# EAGLE design LiPo Charger Plus (EAGLE 9.1.1)
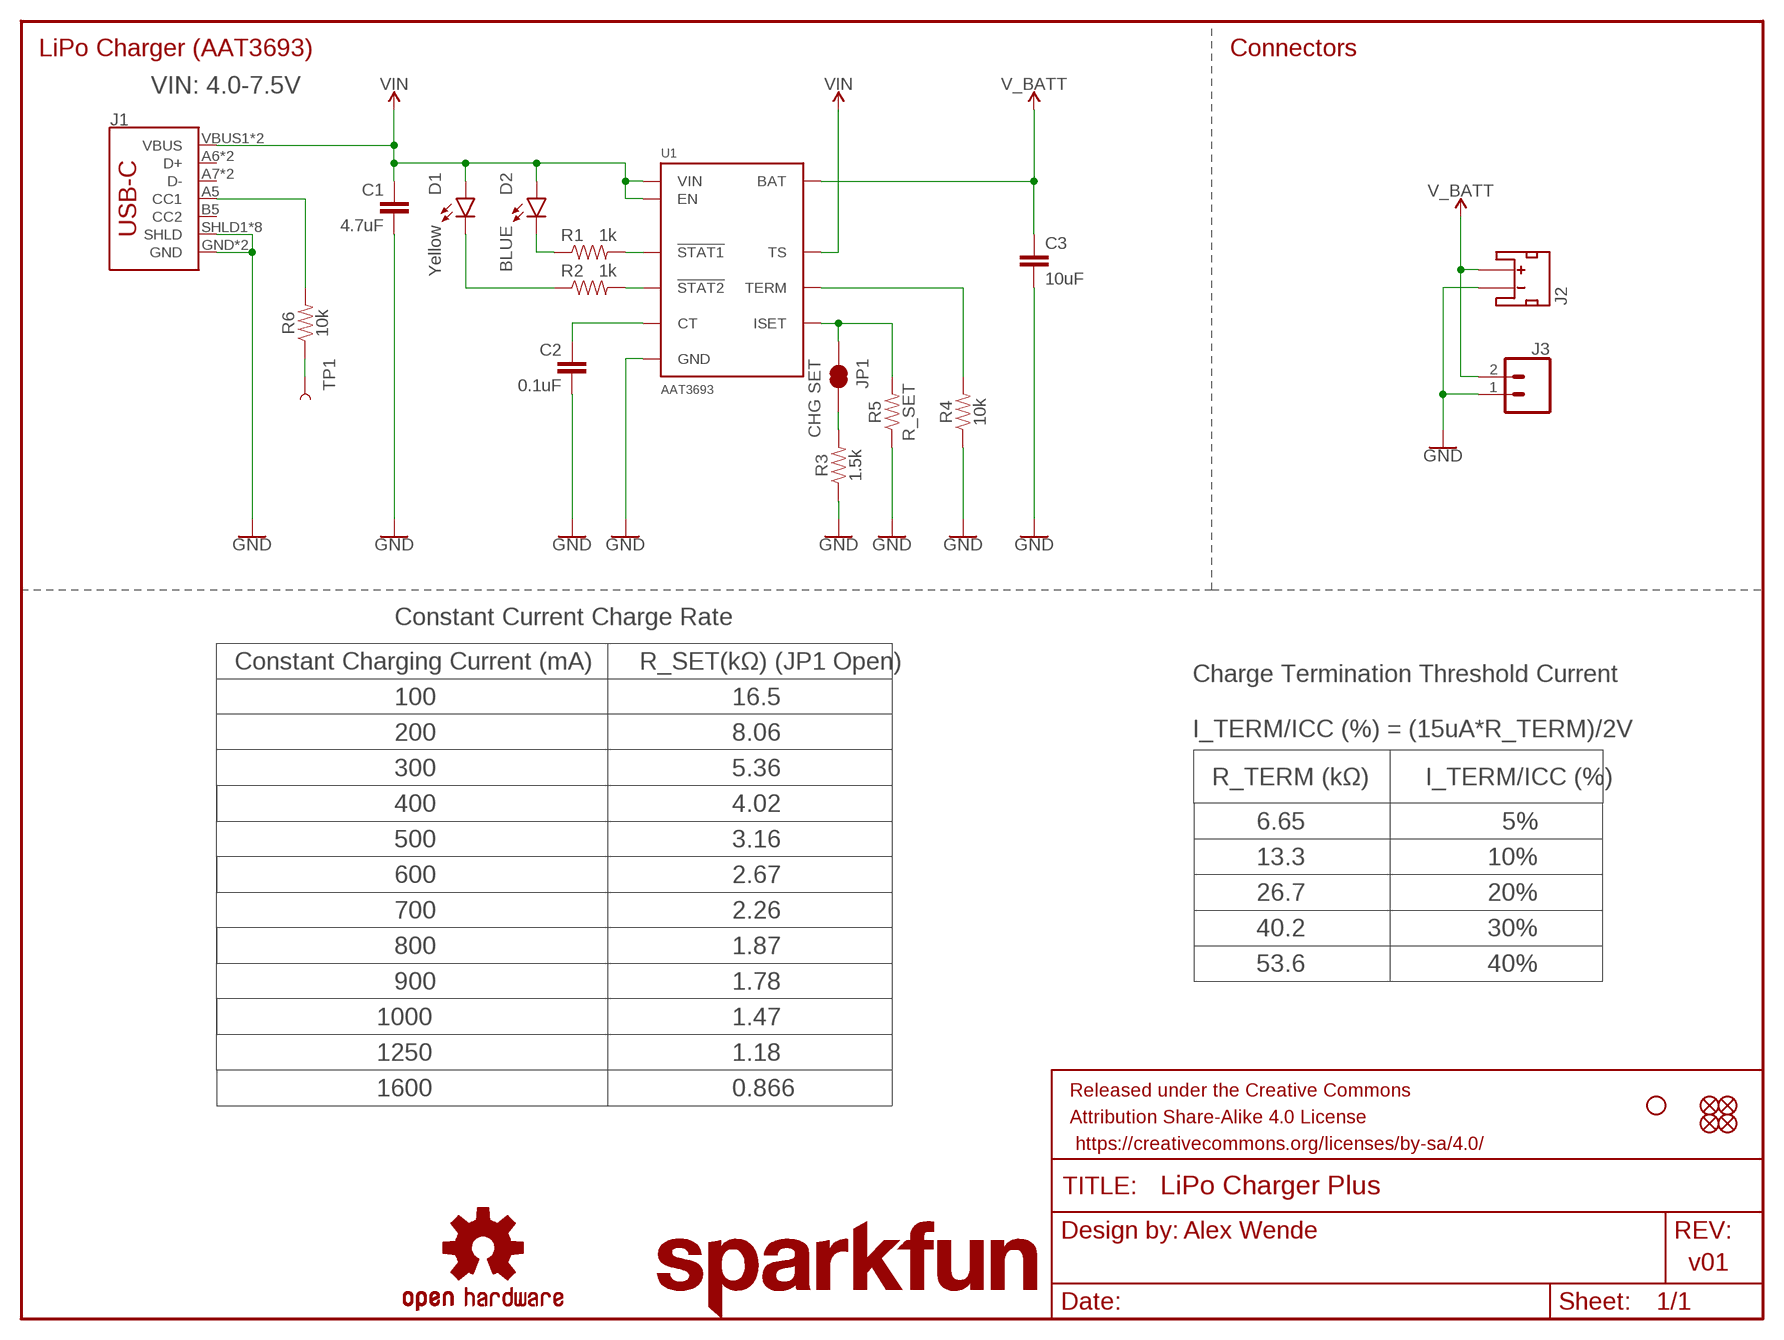
[diagram p0: schematic, sheet 1]

## Parts
C1  4.7uF  4.7UF-0603-35V-(20%)  [0603]
C2  0.1uF  0.1UF-0603-25V-(+80/-20%)  [0603]
C3  10uF  10UF-0603-6.3V-20%  [0603]
D1  Yellow  LED-YELLOW0603  [LED-0603]
D2  BLUE  LED-BLUE0603  [LED-0603]
FD1  FIDUCIALUFIDUCIAL  [FIDUCIAL-MICRO]
FD2  FIDUCIALUFIDUCIAL  [FIDUCIAL-MICRO]
FD3  FIDUCIALUFIDUCIAL  [FIDUCIAL-MICRO]
FD4  FIDUCIALUFIDUCIAL  [FIDUCIAL-MICRO]
FRAME1  FRAME-LETTER  [CREATIVE_COMMONS]
H1  STAND-OFF  [STAND-OFF]
J1  USB_C16PIN  [USB-C-16P]
J2  JST_2MM_MALE  [JST-2-SMD]
J3  CONN_021X02_NO_SILK  [1X02_NO_SILK]
JP1  CHG SET  JUMPER-SMT_2_NC_TRACE_NO-SILK  [SMT-JUMPER_2_NC_TRACE_NO-SILK]
LOGO2  SFE_LOGO_NAME.1_INCH  [SFE_LOGO_NAME_.1]
LOGO3  OSHW-LOGOS  [OSHW-LOGO-S]
R1  1k  1KOHM-0603-1/10W-1%  [0603]
R2  1k  1KOHM-0603-1/10W-1%  [0603]
R3  1.5k  1.5KOHM-0603-1/10W-1%  [0603]
R4  10k  10KOHM-0603-1/10W-1%  [0603]
R5  R_SET  RESISTORAXIAL-0.3  [AXIAL-0.3]
R6  10k  10KOHM-0603-1/10W-1%  [0603]
TP1  TEST-POINTTP_15TH_THRU  [TP_15TH]
U1  AAT3693  [WFDFN-10]

## Nets
GND: C1.2 C2.2 C3.2 J1.GND J1.GND2(GND) J1.SHLD1(SHLD) J1.SHLD2(SHLD) J1.SHLD3(SHLD) J1.SHLD4(SHLD) J1.SHLD5(SHLD) J1.SHLD6(SHLD) J1.SHLD7(SHLD) J1.SHLD8(SHLD) J2.1(-) J3.1 R3.1 R4.1 R5.P$1 U1.P$5(GND) U1.P$11(GND)
N$1: D2.C R1.1
N$2: JP1.2 R3.2
N$3: J1.A5(CC1) R6.2
N$4: D1.C R2.1
N$5: R1.2 U1.P$2(!STAT1)
N$6: R2.2 U1.P$3(!STAT2)
N$7: R6.1 TP1.P$1
N$11: C2.1 U1.P$6(CT)
N$15: JP1.1 R5.P$2 U1.P$7(ISET)
N$16: R4.2 U1.P$8(TERM)
V_BATT: C3.1 J2.2(+) J3.2 U1.P$10(BAT)
VIN: C1.1 D1.A D2.A J1.VBUS1(VBUS) J1.VBUS2(VBUS) U1.P$1(VIN) U1.P$4(EN) U1.P$9(TS)
Unconnected: J1.A6(D+) J1.A7(D-) J1.B5(CC2) J1.B6(D+) J1.B7(D-) J2.NC1(PAD1) J2.NC2(PAD2)

## Notes on the sheet
- LiPo Charger (AAT3693) | Connectors
- VIN: 4.0-7.5V
- Constant Current Charge Rate
- Constant Charging Current (mA) | R_SET(kΩ) (JP1 Open)
- Charge Termination Threshold Current
- 100 | 16.5
- 200 | 8.06 | I_TERM/ICC (%) = (15uA*R_TERM)/2V
- 300 | 5.36
- R_TERM (kΩ) | I_TERM/ICC (%)
- 400 | 4.02
- 6.65 | 5%
- 500 | 3.16
- 13.3 | 10%
- 600 | 2.67
- 26.7 | 20%
- 700 | 2.26
- 40.2 | 30%
- 800 | 1.87
- 53.6 | 40%
- 900 | 1.78
- 1000 | 1.47
- 1250 | 1.18
- 1600 | 0.866
- Alex Wende
- v01

## Library data of the parts
C1 = SparkFun-Capacitors:4.7UF: 4.7µF ceramic capacitors A capacitor is a passive two-terminal electrical component used to store electrical energy temporarily in an electric field.; PROD_ID: CAP-14106
C2 = SparkFun-Capacitors:0.1UF: 0.1µF ceramic capacitors A capacitor is a passive two-terminal electrical component used to store electrical energy temporarily in an electric field.; PROD_ID: CAP-00810
C3 = SparkFun-Capacitors:10UF: 10.0µF ceramic capacitors A capacitor is a passive two-terminal electrical component used to store electrical energy temporarily in an electric field.; PROD_ID: CAP-11015
D1 = SparkFun-LED:LED-YELLOW: Yellow SMD LED Used in manufacturing several products at SparkFun. Packages: 0603 - SMD 0603 package[Product Link] <http://www.kingbrightusa.com/product.asp?catalog_name=LED&product_id=APT1608SYCK> 0603 -SMART - SMART SMD 0603 package (more efficient/more expensive) [Product Link] <http://www.osram-os.com/osram_os/en/products/product-catalog/led-light-emitting-diodes/smartled-0603/ly-l29k/index.jsp> LilyPad - SMD1206 package[Product Datasheet] <https://www.sparkfun.com/datasheets/DevTools/LilyPad/Q150YUS4.pdf> SparkFun Products: Blynk Board <https://www.sparkfun.com/products/13794> IOIO-OTG <https://www.sparkfun.com/products/13613> XBee Explorer Serial <https://www.sparkfun.com/products/13225>; PROD_ID: DIO-09003
D2 = SparkFun-LED:LED-BLUE: Blue SMD LED Used in manufacturing of various products at SparkFun Packages: 0603 - SMD 0603 package [Product Link] <http://www.digikey.com/product-detail/en/SMLE12BC7TT86/511-1589-2-ND/1641808> 1206 - SMD1206 package [Product Link] <http://www.digikey.com/product-detail/en/lite-on-inc/LTST-C150TBKT/160-1643-1-ND/573584> SparkFun Products: ESP8266 Thing-Dev Board <https://www.sparkfun.com/products/13711> RedBoard <https://www.sparkfun.com/products/12757>; PROD_ID: DIO-08575
FD1-FD4 = SparkFun-Aesthetics:FIDUCIAL: Fiducial Alignment Points Point-of-reference for pick-and-place machines and other optical instruments.
FRAME1 = SparkFun-Aesthetics:FRAME-LETTER: Schematic Frame - Letter Standard 8.5x11 US Letter frame
H1 = SparkFun-Hardware:STAND-OFF: Stand Off Drill holes for mechanically mounting via screws, standoffs, etc. Note: Use the keepout ring to avoid running the screw head into surrounding components. Variant Overviews STAND-OFF - Mechanical footprint for a #4 phillips button head screw. STAND-OFF-TIGHT - Mechanical footprint for a #4 phillips button head screw, Example SparkFun Products Screw - Phillips Head (1/4", 4-40, 10 pack) <https://www.sparkfun.com/products/10453> (PRT-10453) Screw - Phillips Head (1/2", 4-40, 10 pack) <https://www.sparkfun.com/products/10452> (PRT-10452) Screw - Phillips Head (3/4", 4-40, 10 pack) <https://www.sparkfun.com/products/10451> (PRT-10451) Screw - Phillips Head (1", 4-40, 10 pack) <https://www.sparkfun.com/products/10450> (PRT-10450)
J1 = SparkFun-Connectors:USB_C: USB Type C 16Pin Connector Super Speed pins not available on the 16-pin purely SMD connector so this part is best for USB 2.0 implementations. D1 and D2 are tied together enabling D+/- no matter which way the cable is plugged into the connector. The two channel configuration pins (CC1/2) are exposed. These are normally connected to ground via 5.1k resistors but can be reconfigured for high current/high power applications.; PROD_ID: CONN-14122
J2 = SparkFun-Connectors:JST_2MM_MALE: JST 2MM MALE RA CONNECTOR Two pin, compact surface mount connector. Commonly used as a battery input connection point. We really like the solid locking feeling and high current rating on these small connectors. We use these all the time as battery connectors. Mates to single-cell LiPo batteries. Here is the connector we sell at SparkFun: JST Right Angle Connector - White <https://www.sparkfun.com/products/8612> (PRT-08612) Datasheet <http://www.sparkfun.com/datasheets/Prototyping/Connectors/JST-Horizontal.pdf> It was used on these SparkFun products: SparkFun MOSFET Power Controller <https://www.sparkfun.com/products/11214> (PRT-11214) SparkFun Battery Babysitter - LiPo Battery Manager <https://www.sparkfun.com/products/13777> (PRT-13777) And many, many others that required a lipo battery connection.; PROD_ID: CONN-11443; SF_ID: PRT-08612
J3 = SparkFun-Connectors:CONN_02: Multi connection point. Often used as Generic Header-pin footprint for 0.1 inch spaced/style header connections On any of the 0.1 inch spaced packages, you can populate with these: Break Away Headers - Straight <https://www.sparkfun.com/products/116> (PRT-00116) Break Away Male Headers - Right Angle <https://www.sparkfun.com/products/553> (PRT-00553) Female Headers <https://www.sparkfun.com/products/115> (PRT-00115) Break Away Headers - Machine Pin <https://www.sparkfun.com/products/117> (PRT-00117) Break Away Female Headers - Swiss Machine Pin <https://www.sparkfun.com/products/743> (PRT-00743) For SCREWTERMINALS and SPRING TERMINALS visit here: Screw Terimnals on SparkFun.com <https://www.sparkfun.com/search/results?term=Screw+Terminals> (5mm/3.5mm/2.54mm spacing) This device is also useful as a general connection point to wire up your design to another part of your project. Our various solder wires solder well into these plated through hole pads. Hook-Up Wire - Assortment (Stranded, 22 AWG) <https://www.sparkfun.com/products/11375> (PRT-11375) Hook-Up Wire - Assortment (Solid Core, 22 AWG) <https://www.sparkfun.com/products/11367> (PRT-11367) View the entire wire category on our website here <https://www.sparkfun.com/categories/141> Special notes: Molex polarized connector foot print use with: PRT-08233 with associated crimp pins and housings. 2.54_SCREWTERM for use with PRT-10571. 3.5mm Screw Terminal footprints for PRT-08084 5mm Screw Terminal footprints for use with PRT-08432
JP1 = SparkFun-Jumpers:JUMPER-SMT_2_NC_TRACE: Normally closed trace jumper This jumper has a trace between two pads so it's normally closed (NC). Use a razor knife to open the connection. For best results follow the IPC guidelines for cutting traces: Cutout at least 0.063 mm (0.005 in). Remove all loose material to clean up the cut area. Seal the cut with an approved epoxy. Reapply solder to reclose the connection.
LOGO2 = SparkFun-Aesthetics:SFE_LOGO_NAME: SparkFun Font Logo This is the SparkFun name logo. The logo on the schematic will always be the same size; the package variant is the height of the flame part of the logo (or the height the flame would be, if it were drawn). Default layer for the logo on the board is tSilk.
LOGO3 = SparkFun-Aesthetics:OSHW-LOGO: Open-Source Hardware (OSHW) Logo This logo indicates the piece of hardware it is found on incorporates a OSHW license and/or adheres to the definition of open source hardware found here: http://freedomdefined.org/OSHW
R1 R2 = SparkFun-Resistors:1KOHM: 1kΩ resistor A resistor is a passive two-terminal electrical component that implements electrical resistance as a circuit element. Resistors act to reduce current flow, and, at the same time, act to lower voltage levels within circuits. - Wikipedia; PROD_ID: RES-07856
R3 = SparkFun-Resistors:1.5KOHM: 1.5kΩ resistor A resistor is a passive two-terminal electrical component that implements electrical resistance as a circuit element. Resistors act to reduce current flow, and, at the same time, act to lower voltage levels within circuits. - Wikipedia; PROD_ID: RES-08306
R4 R6 = SparkFun-Resistors:10KOHM: 10kΩ resistor A resistor is a passive two-terminal electrical component that implements electrical resistance as a circuit element. Resistors act to reduce current flow, and, at the same time, act to lower voltage levels within circuits. - Wikipedia; PROD_ID: RES-00824
R5 = SparkFun-Resistors:RESISTOR: Generic Resistor Package
TP1 = SparkFun-Connectors:TEST-POINT: SparkFun Test Points Bare copper test points for troubleshooting or In-Circuit-Testing. These are used by our Production team for verifying production board runs using pogo-pins on test beds. SparkFun Products: SparkFun LSM9DS1 Breakout <https://www.sparkfun.com/products/13284> SparkFun PSOC <https://www.sparkfun.com/products/13714> SparkFun Load Cell Amplifier <https://www.sparkfun.com/products/13879>
U1 = SparkFun-IC-Power:AAT3693; PROD_ID: IC-14276

## Board
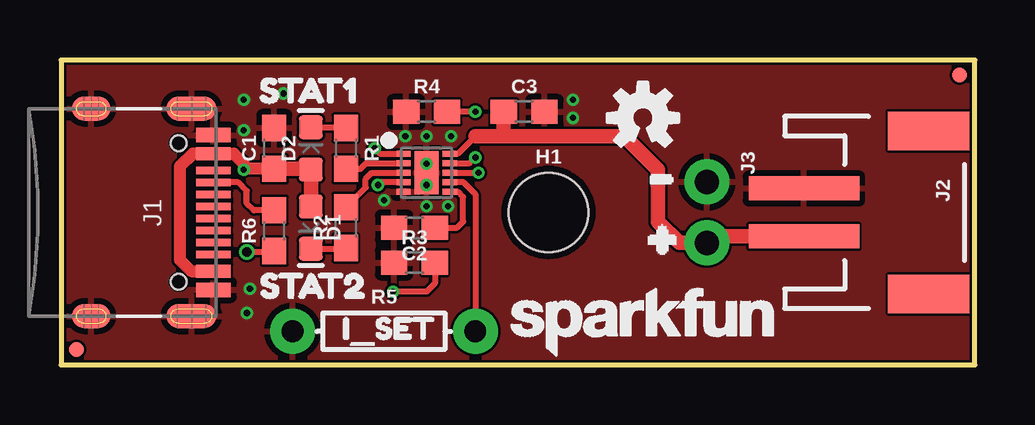
[diagram p1: board, top side]
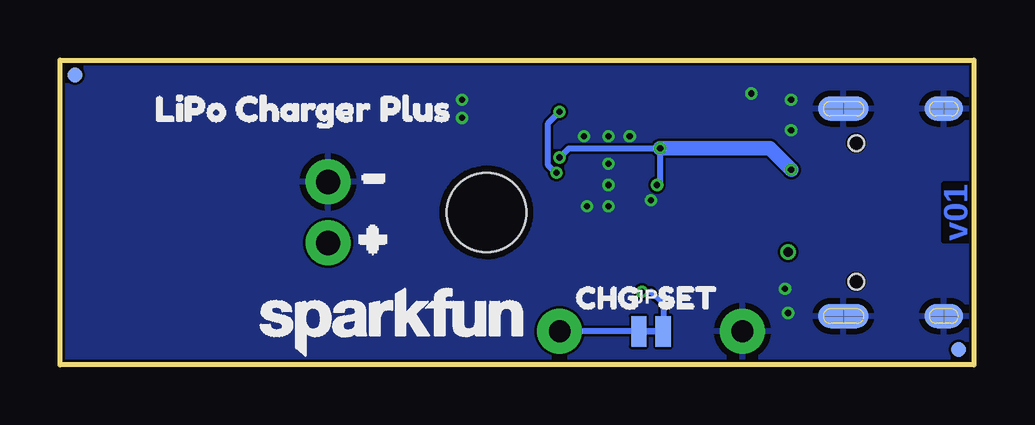
[diagram p2: board, bottom side, seen from below]

Size 38.1 x 12.7 mm. Coordinates in mm from the lower left corner, seen from the top.
Outline: 0,0 38.1,0 38.1,12.7 0,12.7 0,0
Copper layers (1*16): Top 0.035mm / dielectric 1.5mm / Bottom 0.035mm
Design rules "SparkFun-2-layer-FAB-LIMIT": minimum track width 4mil, minimum drill 6mil, track to track 4mil, track to pad 4mil, pad to pad 4mil, via to via 4mil, smd to smd 4mil, copper to edge 4mil, drill to drill 4mil, minimum pad ring 5mil, minimum via ring 5mil, stop-mask expansion 4mil, vias tented up to drill 25mil, thermal gap 10mil

### Footprints (pad centres in the part's own frame; a part is rotated, then mirrored left to right if it is on the bottom)
0603 = smd 1.1 x 1: 1 -0.85,0; 2 0.85,0
LED-0603 = smd 1 x 1: A -0.877,0; C 0.877,0
FIDUCIAL-MICRO = smd 0.635 x 0.635: 1 0,0
STAND-OFF = hole 3.302: 0,0
USB-C-16P = smd 0.3 x 1.45: A5 -1.25,0; A6 -0.25,0; A7 0.25,0; A8 1.25,0; B5 1.75,0; B6 0.75,0; B7 -0.75,0; B8 -1.75,0 | smd 0.6 x 1.45: GND -3.225,0; GND2 3.225,0 | smd 1 x 2.1: SHLD1 -4.32,-0.915; SHLD2 4.32,-0.915 | smd 1 x 2.1 bottom: SHLD3 -4.32,-0.915; SHLD4 4.32,-0.915 | smd 1 x 1.6: SHLD5 -4.32,-5.095; SHLD8 4.32,-5.095 | smd 1 x 1.6 bottom: SHLD6 -4.32,-5.095; SHLD7 4.32,-5.095 | smd 0.55 x 1.45: VBUS1 -2.45,0; VBUS2 2.45,0 | hole 0.65: -2.89,-1.445; 2.89,-1.445
JST-2-SMD = smd 1 x 4.6: 1 -1,-3.7; 2 1,-3.7 | smd 1.6 x 3.4: NC1 -3.4,1.5; NC2 3.4,1.5
1X02_NO_SILK = drill 1.016 pad 1.88: 1 0,0; 2 2.54,0
SMT-JUMPER_2_NC_TRACE_NO-SILK = smd 0.635 x 1.27: 1 -0.508,0; 2 0.508,0
AXIAL-0.3 = drill 0.9 pad 1.88: P$1 -3.81,0; P$2 3.81,0
TP_15TH = drill 0.381 pad 0.61: P$1 0,0
WFDFN-10 = smd 0.6 x 0.25: P$1 -0.96,0.8; P$2 -0.96,0.4; P$3 -0.96,0; P$4 -0.96,-0.4; P$5 -0.96,-0.8; P$6 0.96,-0.8; P$7 0.96,-0.4; P$8 0.96,0; P$9 0.96,0.4; P$10 0.96,0.8 | smd 1 x 1.8: P$11 0,0

### Placement (x,y rotation side)
C1  8.89,9.02 90 top
C2  14.73,5.71 180 top
C3  19.3,10.54 0 top
D1  10.41,5.71 270 top
D2  10.41,9.02 90 top
FD1  0.64,0.64 0 top
FD2  37.47,12.06 0 top
FD3  0.64,0.64 0 bottom
FD4  37.47,12.06 0 bottom
FRAME1  -7.62,-19.05 0 top  (outside the outline)
H1  20.32,6.35 0 top
J1  6.35,6.35 270 top
J2  34.67,6.35 270 top
J3  26.92,7.62 270 top
JP1  13.46,1.4 0 bottom
LOGO2  24.26,1.78 0 bottom
LOGO3  24.26,10.29 0 top
R1  11.87,9.02 270 top
R2  11.87,5.71 90 top
R3  14.73,4.25 0 top
R4  15.24,10.54 0 top
R5  13.46,1.4 0 top
R6  8.89,5.59 90 top
TP1  7.75,4.7 0 top
U1  15.24,8 0 top
U$1  [STAT12]  7.37,11.43 0 top
U$2  [STAT23]  7.37,3.3 0 top
U$3  [I_SET2]  10.92,1.52 0 top
U$4  [#1]  22.86,4.95 180 bottom
U$5  [#0]  22.86,7.37 180 bottom
U$6  [LIPO_CHARGER_PLUS5]  35.05,10.67 0 bottom
U$7  [CHG2]  17.4,2.79 0 bottom
U$8  [SET3]  13.97,2.79 0 bottom
U$10  [SFE_LOGO_NAME_.1]  24.26,1.78 0 top
U$11  [#1]  22.86,5.46 0 top
U$12  [#0]  22.86,8.13 0 top

### Tracks (layer width: path | path; a pad name or v marks a point on that pad's centre or on a via)
GND  (via drill 0.25)
  other vias: 13.46,6.86 16.13,6.6 15.24,6.6 16.26,9.53 15.24,9.53 14.35,9.53 15.24,8.38 15.24,7.49 7.87,3.17 7.75,2.16 7.62,9.78 21.34,10.29 21.34,11.05 7.62,11.05 9.27,11.3
  pour Top (rank 2): 0,0 0,12.7 38.1,12.7 38.1,0
  pour Bottom (rank 2): 0,12.7 0,0 38.1,0 38.1,12.7
N$1
  Top 0.254: D2.C 11.85,9.89 R1.1
N$2  (via drill 0.25)
  Top 0.254: R3.2 15.58,3.39 15.24,3.05 v13.84,3.05
  Bottom 0.254: v13.84,3.05 13.46,3.05 12.95,2.54 JP1.2
N$3
  Top 0.254: R6.2 8.04,6.44 7.75,6.73 7.75,7.24 7.39,7.6 J1.A5
N$4
  Top 0.254: D1.C 11.85,4.84 R2.1
N$5
  Top 0.254: R1.2 12.48,8.17 12.72,8.4 U1.P$2
N$6
  Top 0.254: R2.2 12.7,7.39 12.7,7.75 12.95,8 U1.P$3
N$7
  Top 0.254: R6.1 8.85,4.7 TP1.P$1
N$11
  Top 0.254: C2.1 16.51,5.71 16.76,5.97 16.76,6.99 16.55,7.2 U1.P$6
N$15
  Top 0.254: U1.P$7 16.78,7.6 17.27,7.11 R5.P$2
  Bottom 0.254: JP1.1 R5.P$2
N$16  (via drill 0.25)
  Top 0.254: U1.P$8 v17.4,8 | v17.27,10.54 R4.2
  Bottom 0.254: v17.4,8 17.45,8 17.75,8.31 17.75,10.06 v17.27,10.54
V_BATT
  Top 0.254: U1.P$10 16.55,8.8 17.27,9.53
  Top 0.61: 17.27,9.53 18.45,9.53 | 18.45,9.53 23.5,9.53 24.89,8.13 24.89,5.97 25.78,5.08 J3.2 27.19,5.35 J2.2 | C3.1 18.45,9.53
VIN  (via drill 0.25)
  Top 0.254: v13.08,9.02 13.3,8.8 U1.P$1 | U1.P$4 13.32,7.6 v13.21,7.49 | U1.P$9 17.04,8.4 v17.27,8.64
  Top 0.508: C1.1 7.62,8.17 | 7.62,8.17 v7.62,8.13 | J1.VBUS2 5.43,3.9 4.95,4.38 4.95,8.26 5.5,8.8 J1.VBUS1 7.2,8.8 7.62,8.38 7.62,8.17
  Top 0.61: C1.1 10.41,8.17 D2.A D1.A
  Bottom 0.254: v13.21,7.49 13.08,7.62 v13.08,9.02 16.89,9.02 v17.27,8.64
  Bottom 0.61: v7.62,8.13 8.51,9.02 v13.08,9.02

### Text on the board
Bottom: v01
tDocu: Alex Wende